# EasyEDA schematic SCH_Astavel and Monostable Clock Circuit_2021-10-04.json
TITLE: Sistema de Clock Astavel e Manual; REV: 1.0; Date: 2018-11-08; Sheet: 1/1; Drawn By: Marcos Silva D. S.
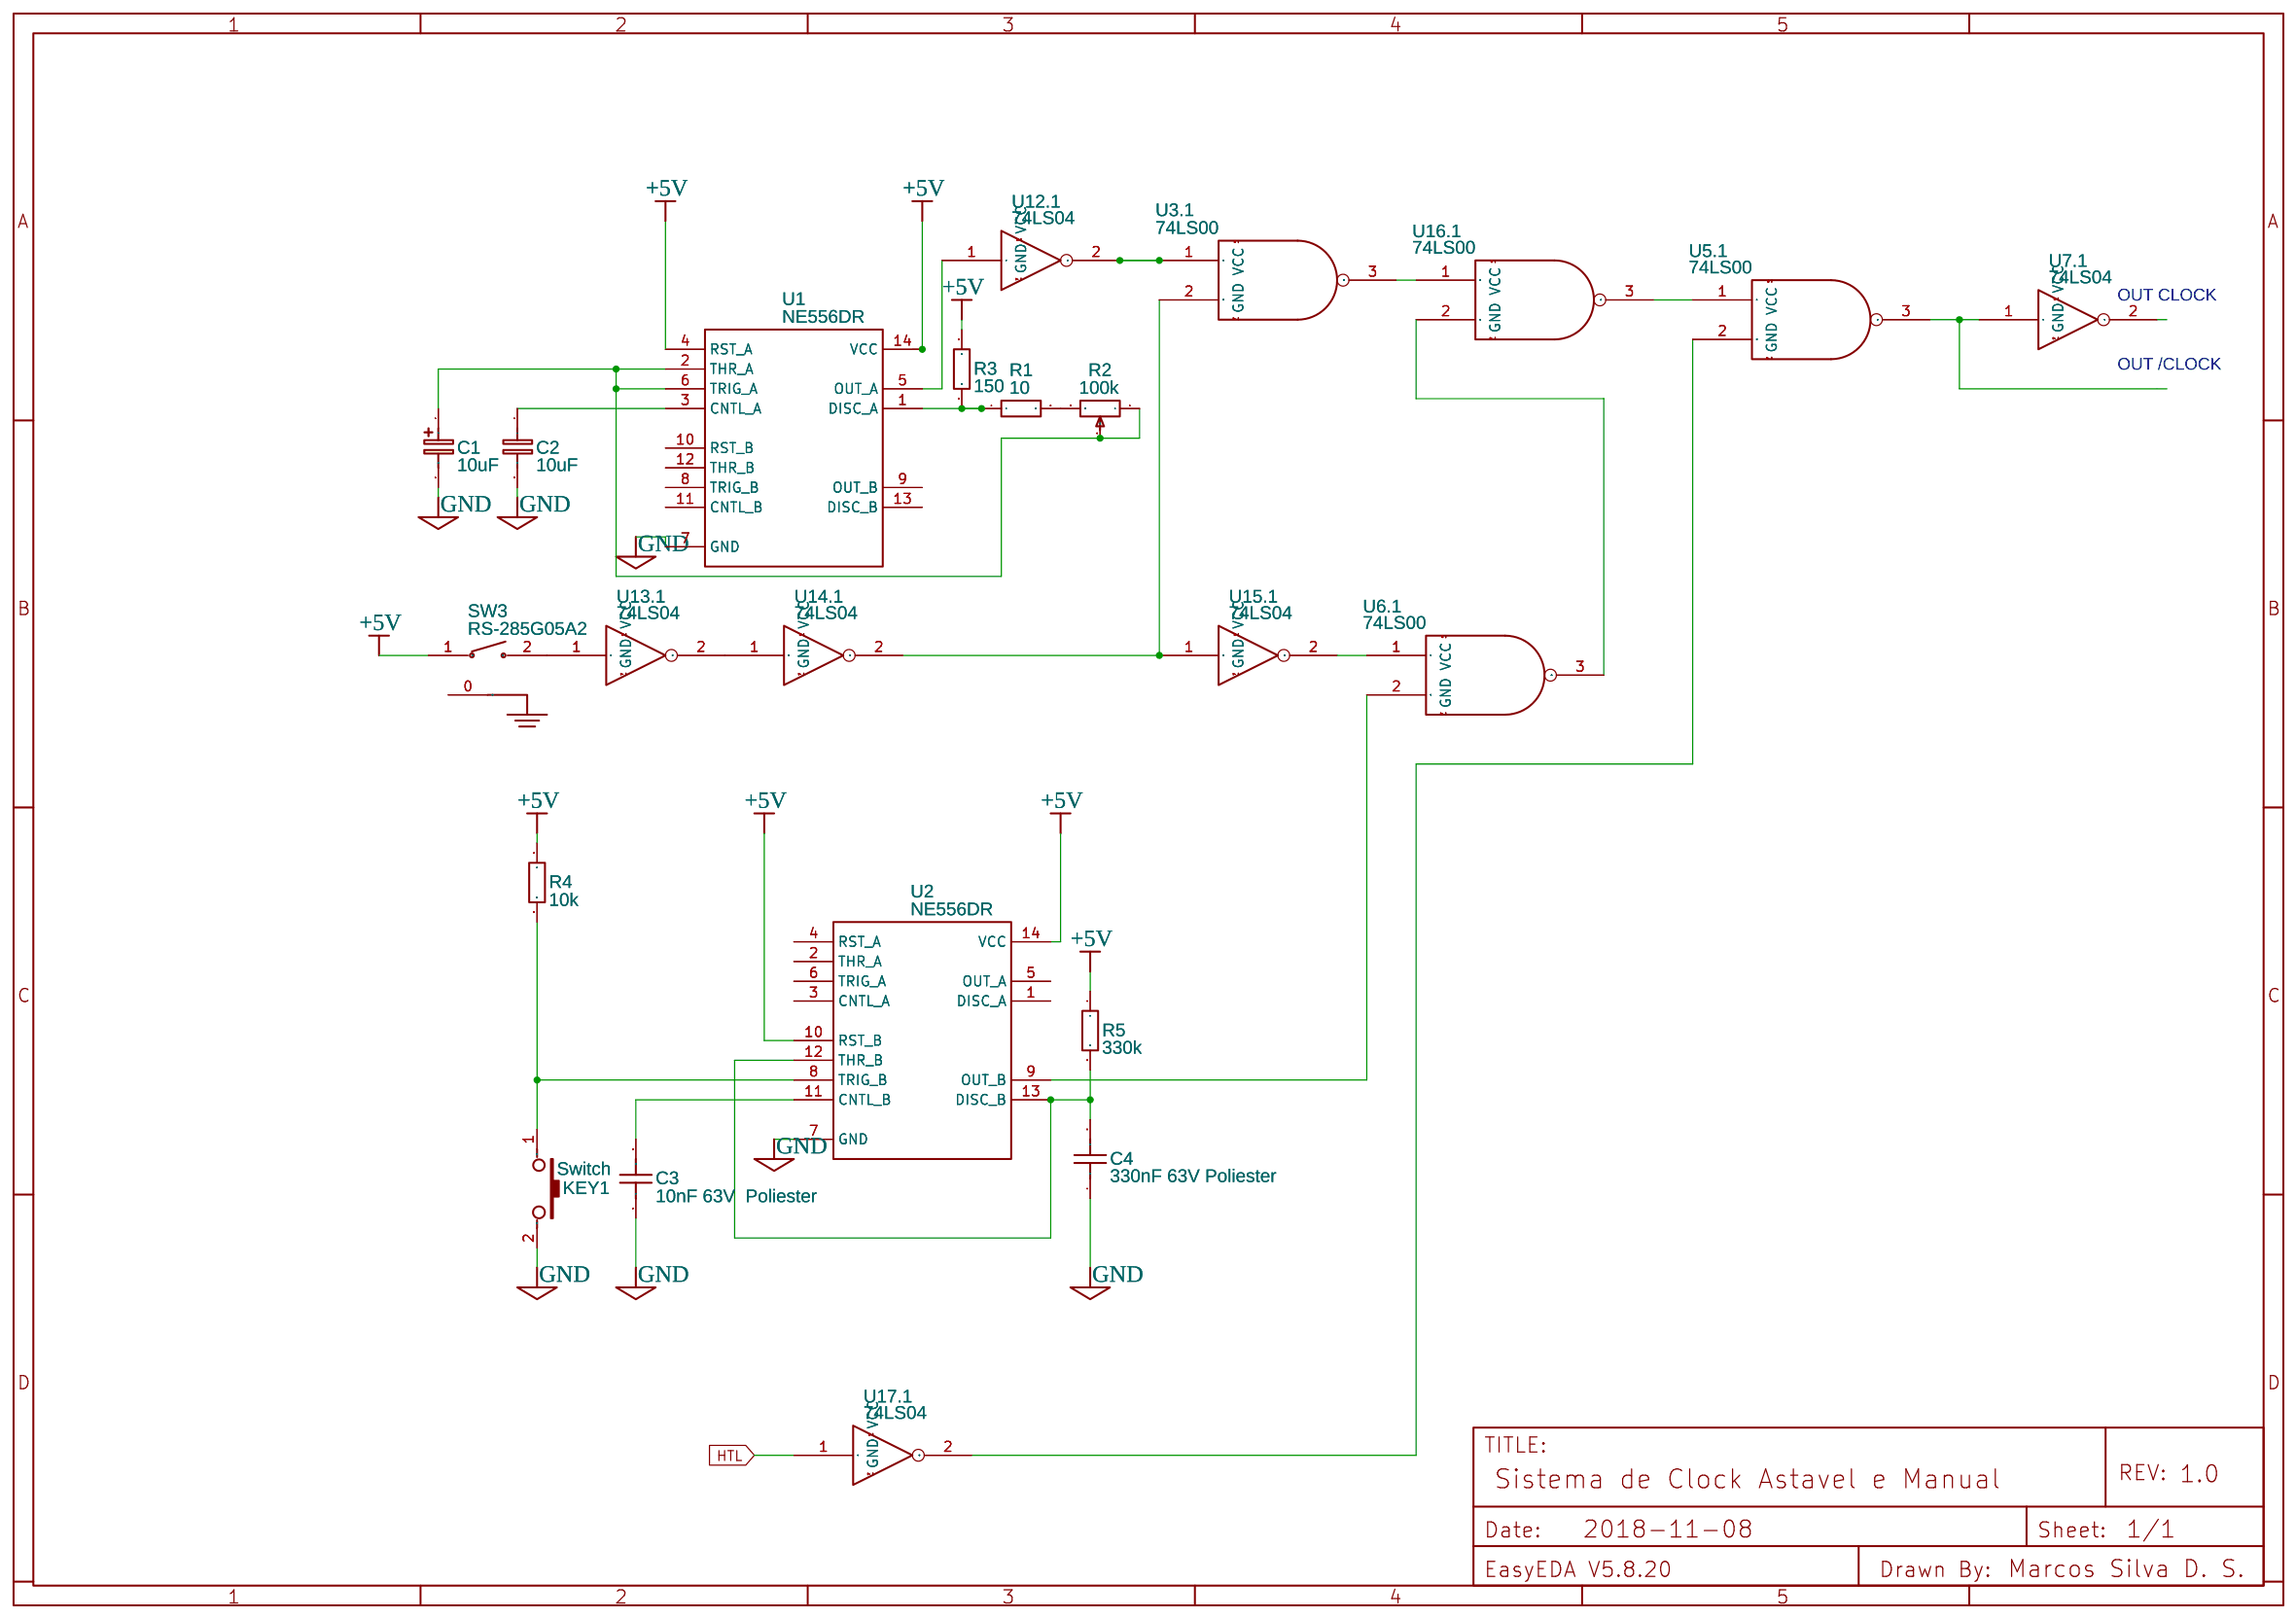
[diagram p0: schematic sheet]

## Parts
C1  10uF  [CAP-D3.0XF1.5]
C2  10uF  [RAD-0.1]
C3  10nF 63V  Poliester  [RAD-0.1]
C4  330nF 63V Poliester  [RAD-0.1]
KEY1  Switch  [KEY-3.0*4.0]
R1  10  [AXIAL-0.3]
R2  100k  [RES-ADJ_3386P]
R3  150  [AXIAL-0.3]
R4  10k  [AXIAL-0.3]
R5  330k  [AXIAL-0.3]
SW3  RS-285G05A2  [KEY-6.0X3.6X2.5MM]
U1  NE556DR  [SOIC-14_150MIL]
U2  NE556DR  [SOIC-14_150MIL]
U3  74LS00  [74LS04 DIP-14]  (section 1)
U5  74LS00  [74LS04 DIP-14]  (section 1)
U6  74LS00  [74LS04 DIP-14]  (section 1)
U7  74LS04  [74LS04 DIP-14]  (section 1)
U12  74LS04  [74LS04 DIP-14]  (section 1)
U13  74LS04  [74LS04 DIP-14]  (section 1)
U14  74LS04  [74LS04 DIP-14]  (section 1)
U15  74LS04  [74LS04 DIP-14]  (section 1)
U16  74LS00  [74LS04 DIP-14]  (section 1)
U17  74LS04  [74LS04 DIP-14]  (section 1)

## Library data of the parts
C1 = Cap_Electrolytic(TH)_D3.0XF1.5_EU: Contributor: EasyEDA; Manufacturer Part: ?
C2 = Cap_RAD-0.1_EU: Manufacturer Part: ?
C3 C4 = Cap_RAD-0.1_US: Manufacturer Part: ?
KEY1 = -: Supplier: LCSC; Manufacturer: ReliaPro; Manufacturer Part: Switch3x4x2; Contributor: LCSC; Supplier Part: C26638
R1 R3-R5 = Res_AXIAL-0.3(1/8W)_EU: Manufacturer Part: ?
R2 = 3386P-1-101LF: Supplier Part: C125022; Supplier: LCSC; Manufacturer: Bochen
SW3 = -: Supplier: LCSC; Supplier Part: C221931; Manufacturer: C&K; Manufacturer Part: RS-285G05A2-URT; Contributor: LCSC
U1 U2 = -: Supplier: LCSC; Manufacturer: TI; image: //image.lceda.cn/szlcsc/C7427.jpg; Contributor: LCSC; Supplier Part: C7427
U3 U5-U7 U12-U17 = -: Contributor: KiCad; Manufacturer Part: ?

## Nets
+5V: R3.1 R4.1 R5.1 SW3.1 U1.4(RST A) U1.14(VCC) U2.10(RST B) U2.14(VCC)
GND: C1.2 C2.2 C3.1 C4.1 KEY1.2 U1.7(GND) U2.7(GND)
HTL: U17.1
Net-(C1-1): C1.1 R2.1 R2.2 U1.2(THR A) U1.6(TRIG A)
Net-(C2-1): C2.1 U1.3(CNTL A)
Net-(C3-2): C3.2 U2.11(CNTL B)
Net-(C4-2): C4.2 R5.2 U2.12(THR B) U2.13(DISC B)
Net-(KEY1-1): KEY1.1 R4.2 U2.8(TRIG B)
Net-(R1-1): R1.1 R3.2 U1.1(DISC A)
Net-(R1-2): R1.2 R2.3
Net-(SW3-2): SW3.2 U13.1
Net-(U1-5): U1.5(OUT A) U12.1
Net-(U2-9): U2.9(OUT B) U6.2
Net-(U3.1-1): U3.1 U12.2
Net-(U3.1-2): U3.2 U14.2 U15.1
Net-(U3.1-3): U3.3 U16.1
Net-(U5.1-1): U5.1 U16.3
Net-(U5.1-2): U5.2 U17.2
Net-(U5.1-3): U5.3 U7.1
Net-(U6.1-1): U6.1 U15.2
Net-(U6.1-3): U6.3 U16.2
Net-(U13.1-2): U13.2 U14.1

Not connected (* = marked no-connect by the designer): SW3 0; U1 8(TRIG B) 9(OUT B) 10(RST B) 11(CNTL B) 12(THR B) 13(DISC B); U2 1(DISC A) 2(THR A) 3(CNTL A) 4(RST A) 5(OUT A) 6(TRIG A); U3 7(GND) 14(VCC); U5 7(GND) 14(VCC); U6 7(GND) 14(VCC); U7 2 7(GND) 14(VCC); U12 7(GND) 14(VCC); U13 7(GND) 14(VCC); U14 7(GND) 14(VCC); U15 7(GND) 14(VCC); U16 7(GND) 14(VCC); U17 7(GND) 14(VCC)

## Notes on the sheet
- OUT CLOCK
- OUT /CLOCK
